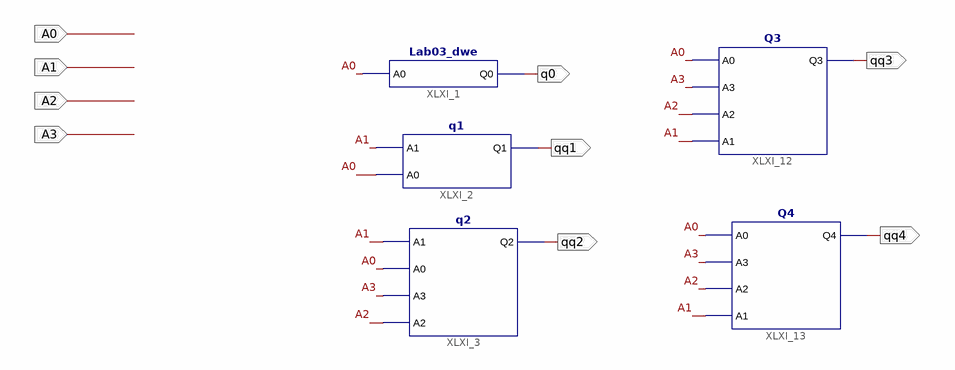
[diagram p0: schematic sheet 1]
// Xilinx ISE schematic PRELAB.sch (spartan3) as structural Verilog: 5 symbols, 9 ports
module PRELAB (
  input  A0,
  input  A1,
  input  A2,
  input  A3,
  output q0,
  output qq1,
  output qq2,
  output qq3,
  output qq4
);

  Lab03_dwe XLXI_1 (.A0(A0), .Q0(q0));
  q1 XLXI_2 (.A0(A0), .A1(A1), .Q1(qq1));
  q2 XLXI_3 (.A0(A0), .A1(A1), .A2(A2), .A3(A3), .Q2(qq2));
  Q3 XLXI_12 (.A0(A0), .A1(A1), .A2(A2), .A3(A3), .Q3(qq3));
  Q4 XLXI_13 (.A0(A0), .A1(A1), .A2(A2), .A3(A3), .Q4(qq4));
endmodule
